# Altium project SMD.PrjPCB
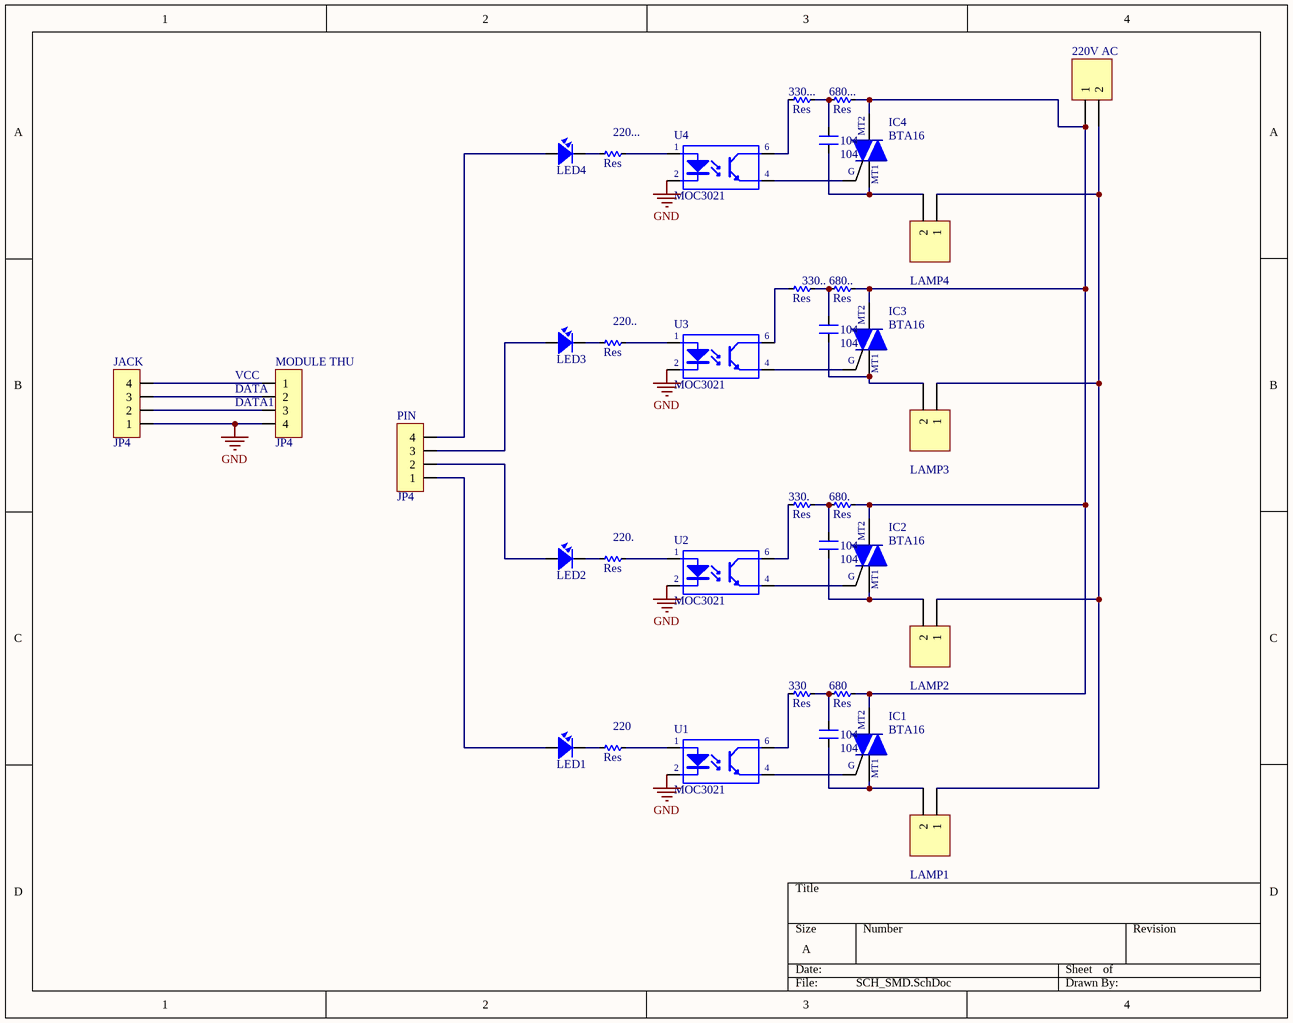
[diagram p0: SCH_SMD.SchDoc]
1 sheet, 36 parts. Net scope: global (net labels, ports and power ports of the same name join across sheets).
Board file: PCB_SMD.PcbDoc

## Sheet SCH_SMD.SchDoc
size A

### Parts
(Parts that share a designator on the sheet are numbered #1, #2 ... from top to bottom, then left to right.)
104#1  104  [CN2]
104#2  104  [CN2]
104#3  104  [CN2]
104#4  104  [CN2]
220  Res  [RES-1/4W-SMALL]
220.  Res  [RES-1/4W-SMALL]
220..  Res  [RES-1/4W-SMALL]
220...  Res  [RES-1/4W-SMALL]
220V_AC  Header 2_1  [HED2]  (value not drawn)
330  Res  [RES-1/4W-SMALL]
330.  Res  [RES-1/4W-SMALL]
330..  Res  [RES-1/4W-SMALL]
330...  Res  [RES-1/4W-SMALL]
680  Res  [RES-1/4W-SMALL]
680.  Res  [RES-1/4W-SMALL]
680..  Res  [RES-1/4W-SMALL]
680...  Res  [RES-1/4W-SMALL]
IC1  BTA16  [QTO-220]
IC2  BTA16  [QTO-220]
IC3  BTA16  [QTO-220]
IC4  BTA16  [QTO-220]
JACK  JP4  [JP4-C1T]
LAMP1  Header 2_1  [HED2]  (value not drawn)
LAMP2  Header 2_1  [HED2]  (value not drawn)
LAMP3  Header 2_1  [HED2]  (value not drawn)
LAMP4  Header 2_1  [HED2]  (value not drawn)
LED1  LED  [LED-3MM-YELLOW]  (value not drawn)
LED2  LED  [LED-3MM-YELLOW]  (value not drawn)
LED3  LED  [LED-3MM-YELLOW]  (value not drawn)
LED4  LED  [LED-3MM-YELLOW]  (value not drawn)
MODULE_THU  JP4  [JP4-C1T]
PIN  JP4  [JP4-C1T]
U1  MOC3021  [DIP6/W0.3]
U2  MOC3021  [DIP6/W0.3]
U3  MOC3021  [DIP6/W0.3]
U4  MOC3021  [DIP6/W0.3]

### Nets
GND: JACK.1 MODULE_THU.4 U1.2(K) U2.2(K) U3.2(K) U4.2(K)
Net104#1_1: 104#1.1 IC4.1(MT1) LAMP4.2
Net104#1_2: 104#1.2 330....1 680....2
Net104#2_1: 104#2.1 IC3.1(MT1) LAMP3.2
Net104#2_2: 104#2.2 330...1 680...2
Net104#3_1: 104#3.1 IC2.1(MT1) LAMP2.2
Net104#3_2: 104#3.2 330..1 680..2
Net104#4_1: 104#4.1 IC1.1(MT1) LAMP1.2
Net104#4_2: 104#4.2 330.1 680.2
Net220..._1: 220....1 U4.1(A)
Net220..._2: 220....2 LED4.2
Net220.._1: 220...1 U3.1(A)
Net220.._2: 220...2 LED3.2
Net220._1: 220..1 U2.1(A)
Net220._2: 220..2 LED2.2
Net220_1: 220.1 U1.1(A)
Net220_2: 220.2 LED1.2
Net220V_AC_1: 220V_AC.1 680.1 680..1 680...1 680....1 IC1.2(MT2) IC2.2(MT2) IC3.2(MT2) IC4.2(MT2)
Net220V_AC_2: 220V_AC.2 LAMP1.1 LAMP2.1 LAMP3.1 LAMP4.1
Net330..._2: 330....2 U4.6(C)
Net330.._2: 330...2 U3.6(C)
Net330._2: 330..2 U2.6(C)
Net330_2: 330.2 U1.6(C)
NetIC1_3: IC1.3(IN) U1.4(E)
NetIC2_3: IC2.3(IN) U2.4(E)
NetIC3_3: IC3.3(IN) U3.4(E)
NetIC4_3: IC4.3(IN) U4.4(E)
NetJACK_2: JACK.2 MODULE_THU.3
NetJACK_3: JACK.3 MODULE_THU.2
NetJACK_4: JACK.4 MODULE_THU.1
NetLED1_1: LED1.1 PIN.1
NetLED2_1: LED2.1 PIN.2
NetLED3_1: LED3.1 PIN.3
NetLED4_1: LED4.1 PIN.4

### Notes on the sheet
- (near MODULE_THU) VCC
- (near MODULE_THU) DATA
- (near MODULE_THU) DATA1
- (in symbol BT137) G

### Library data of the parts
104#1-104#4 = CN2: Cap np 104 => 105pF; Value: 0.1uF
220 220. 220.. 220... 330 330. 330.. 330... 680 680. 680.. 680... = Res: Manufacturer: Generic Components; Class: Passive; SubClass: R; Published: 08/06/2000; Publisher: Altium Hobart Technology Centre
220V_AC LAMP1-LAMP4 = Header 2_1: Header, 2-Pin; Manufacturer: Generic Components; Class: Connector; Value: Header 2
IC1-IC4 = BT137: Triacs - 8A; Value: LM317
JACK MODULE_THU PIN = JP4: WR-PHD 2.54 mm Angled Socket Header; Manufacturer: Würth Elektronik eiSos GmbH; partNo: 613004143121; ComponentLink1 Description: Manufacturer; ComponentLink2 Description: Datasheet; NoPins: 04; Created Date: 29 March 2013; ComponentLink1URL: http://www.we-online.com; ComponentLink2URL: http://katalog.we-online.de/em/datasheet/6130xx143121.pdf; Created by: Karrer Zheng
LED1-LED4 = LED: LED Single colour Green and Red; Value: LED 3 ly Single Colour
U1-U4 = MOC3021: Single Opto; Value: MOC3021